# Altium schematic sheet Revision_History.SchDoc: Apalis Evaluation Board 1.1
size A3; Organization: Toradex AG; Address1: Altsagenstrasse 5; Address2: Horw; Address3: 6048; Address4: Switzerland; DocumentNumber: 1; Revision: V1.1; SheetNumber: 1; SheetTotal: 32; PageSetup: Record=PageOptions|CenterHorizontal=True|CenterVertical=True|PrintScale=0.73|XCorrection=1.00|YCorrection=1.00|PrintKind=0|BorderSize=5000000|LeftOffset=0|BottomOffset=0|Orientation=2|PaperLength=1000|PaperWidth=1000|Scale=100|PaperSource=7|PrintQuality=-4|MediaType=1|DitherType=10|PaperKind=A4|PrintScaleMode=1
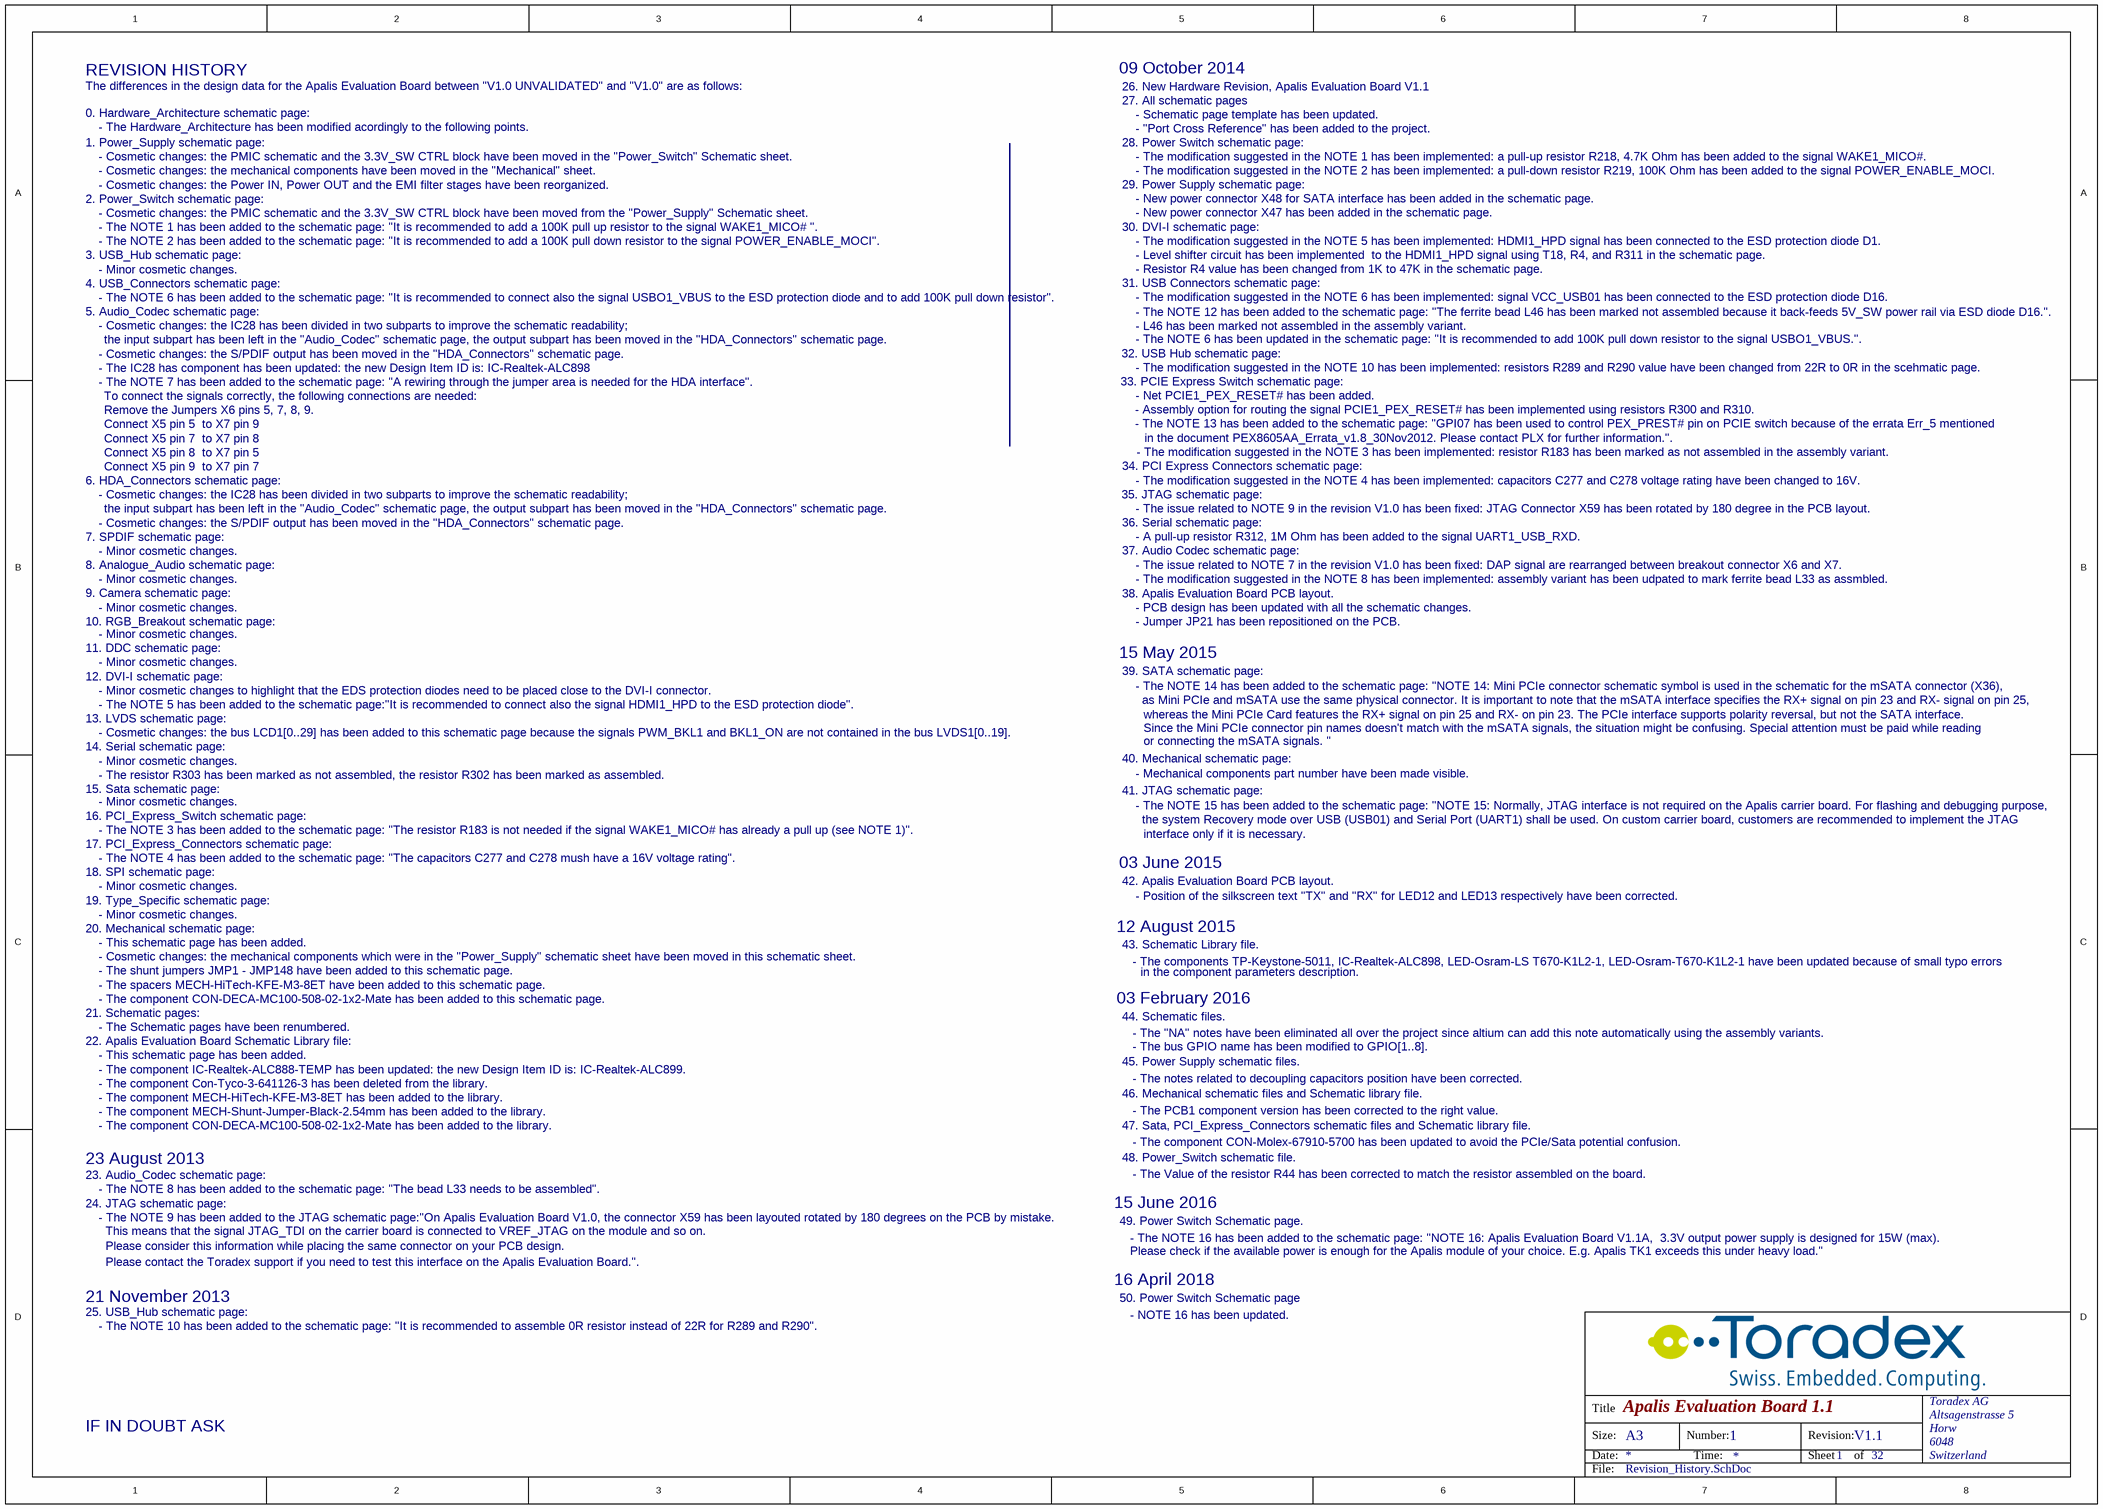
[diagram p0: Revision_History.SchDoc]

## Notes on the sheet
- The differences in the design data for the Apalis Evaluation Board between "V1.0 UNVALIDATED" and "V1.0" are as follows:
- REVISION HISTORY
- 09 October 2014
- 27. All schematic pages
- 26. New Hardware Revision, Apalis Evaluation Board V1.1
- 1. Power_Supply schematic page:
- 0. Hardware_Architecture schematic page:
- - Cosmetic changes: the PMIC schematic and the 3.3V_SW CTRL block have been moved in the "Power_Switch" Schematic sheet.
- - The Hardware_Architecture has been modified acordingly to the following points.
- - Cosmetic changes: the mechanical components have been moved in the "Mechanical" sheet.
- 28. Power Switch schematic page:
- - The modification suggested in the NOTE 2 has been implemented: a pull-down resistor R219, 100K Ohm has been added to the signal POWER_ENABLE_MOCI.
- - The modification suggested in the NOTE 1 has been implemented: a pull-up resistor R218, 4.7K Ohm has been added to the signal WAKE1_MICO#.
- - Schematic page template has been updated.
- - "Port Cross Reference" has been added to the project.
- 2. Power_Switch schematic page:
- - Cosmetic changes: the Power IN, Power OUT and the EMI filter stages have been reorganized.
- - Cosmetic changes: the PMIC schematic and the 3.3V_SW CTRL block have been moved from the "Power_Supply" Schematic sheet.
- - The NOTE 1 has been added to the schematic page: "It is recommended to add a 100K pull up resistor to the signal WAKE1_MICO# ".
- - The NOTE 2 has been added to the schematic page: "It is recommended to add a 100K pull down resistor to the signal POWER_ENABLE_MOCI".
- 30. DVI-I schematic page:
- 29. Power Supply schematic page:
- - New power connector X48 for SATA interface has been added in the schematic page.
- - The modification suggested in the NOTE 5 has been implemented: HDMI1_HPD signal has been connected to the ESD protection diode D1.
- - New power connector X47 has been added in the schematic page.
- 3. USB_Hub schematic page:
- 4. USB_Connectors schematic page:
- 5. Audio_Codec schematic page:
- - The NOTE 6 has been added to the schematic page: "It is recommended to connect also the signal USBO1_VBUS to the ESD protection diode and to add 100K pull down resistor".
- - Minor cosmetic changes.
- 31. USB Connectors schematic page:
- - Level shifter circuit has been implemented  to the HDMI1_HPD signal using T18, R4, and R311 in the schematic page.
- - Resistor R4 value has been changed from 1K to 47K in the schematic page.
- - The modification suggested in the NOTE 6 has been implemented: signal VCC_USB01 has been connected to the ESD protection diode D16.
- - The NOTE 12 has been added to the schematic page: "The ferrite bead L46 has been marked not assembled because it back-feeds 5V_SW power rail via ESD diode D16.".
- - Cosmetic changes: the IC28 has been divided in two subparts to improve the schematic readability;
- - Cosmetic changes: the S/PDIF output has been moved in the "HDA_Connectors" schematic page.
- - The IC28 has component has been updated: the new Design Item ID is: IC-Realtek-ALC898
- the input subpart has been left in the "Audio_Codec" schematic page, the output subpart has been moved in the "HDA_Connectors" schematic page.
- 33. PCIE Express Switch schematic page:
- 32. USB Hub schematic page:
- - L46 has been marked not assembled in the assembly variant.
- - The modification suggested in the NOTE 10 has been implemented: resistors R289 and R290 value have been changed from 22R to 0R in the scehmatic page.
- - The NOTE 6 has been updated in the schematic page: "It is recommended to add 100K pull down resistor to the signal USBO1_VBUS.".
- - The NOTE 7 has been added to the schematic page: "A rewiring through the jumper area is needed for the HDA interface".
- To connect the signals correctly, the following connections are needed:
- Remove the Jumpers X6 pins 5, 7, 8, 9.
- Connect X5 pin 7  to X7 pin 8
- Connect X5 pin 5  to X7 pin 9
- - Assembly option for routing the signal PCIE1_PEX_RESET# has been implemented using resistors R300 and R310.
- - The NOTE 13 has been added to the schematic page: "GPI07 has been used to control PEX_PREST# pin on PCIE switch because of the errata Err_5 mentioned
- - Net PCIE1_PEX_RESET# has been added.
- in the document PEX8605AA_Errata_v1.8_30Nov2012. Please contact PLX for further information.".
- 6. HDA_Connectors schematic page:
- Connect X5 pin 9  to X7 pin 7
- Connect X5 pin 8  to X7 pin 5
- 35. JTAG schematic page:
- 34. PCI Express Connectors schematic page:
- - The modification suggested in the NOTE 4 has been implemented: capacitors C277 and C278 voltage rating have been changed to 16V.
- - The issue related to NOTE 9 in the revision V1.0 has been fixed: JTAG Connector X59 has been rotated by 180 degree in the PCB layout.
- - The modification suggested in the NOTE 3 has been implemented: resistor R183 has been marked as not assembled in the assembly variant.
- 7. SPDIF schematic page:
- 8. Analogue_Audio schematic page:
- 36. Serial schematic page:
- 37. Audio Codec schematic page:
- - A pull-up resistor R312, 1M Ohm has been added to the signal UART1_USB_RXD.
- - The issue related to NOTE 7 in the revision V1.0 has been fixed: DAP signal are rearranged between breakout connector X6 and X7.
- - The modification suggested in the NOTE 8 has been implemented: assembly variant has been udpated to mark ferrite bead L33 as assmbled.
- 9. Camera schematic page:
- 10. RGB_Breakout schematic page:
- 11. DDC schematic page:
- 38. Apalis Evaluation Board PCB layout.
- - Jumper JP21 has been repositioned on the PCB.
- - PCB design has been updated with all the schematic changes.
- 12. DVI-I schematic page:
- 13. LVDS schematic page:
- - Minor cosmetic changes to highlight that the EDS protection diodes need to be placed close to the DVI-I connector.
- - The NOTE 5 has been added to the schematic page:"It is recommended to connect also the signal HDMI1_HPD to the ESD protection diode".
- 15 May 2015
- 39. SATA schematic page:
- - The NOTE 14 has been added to the schematic page: "NOTE 14: Mini PCIe connector schematic symbol is used in the schematic for the mSATA connector (X36),
- as Mini PCIe and mSATA use the same physical connector. It is important to note that the mSATA interface specifies the RX+ signal on pin 23 and RX- signal on pin 25,
- whereas the Mini PCIe Card features the RX+ signal on pin 25 and RX- on pin 23. The PCIe interface supports polarity reversal, but not the SATA interface.
- 14. Serial schematic page:
- - Cosmetic changes: the bus LCD1[0..29] has been added to this schematic page because the signals PWM_BKL1 and BKL1_ON are not contained in the bus LVDS1[0..19].
- - The resistor R303 has been marked as not assembled, the resistor R302 has been marked as assembled.
- 40. Mechanical schematic page:
- - Mechanical components part number have been made visible.
- Since the Mini PCIe connector pin names doesn't match with the mSATA signals, the situation might be confusing. Special attention must be paid while reading
- or connecting the mSATA signals. "
- 15. Sata schematic page:
- 16. PCI_Express_Switch schematic page:
- 17. PCI_Express_Connectors schematic page:
- - The NOTE 3 has been added to the schematic page: "The resistor R183 is not needed if the signal WAKE1_MICO# has already a pull up (see NOTE 1)".
- 41. JTAG schematic page:
- - The NOTE 15 has been added to the schematic page: "NOTE 15: Normally, JTAG interface is not required on the Apalis carrier board. For flashing and debugging purpose,
- the system Recovery mode over USB (USB01) and Serial Port (UART1) shall be used. On custom carrier board, customers are recommended to implement the JTAG
- interface only if it is necessary.
- 18. SPI schematic page:
- 19. Type_Specific schematic page:
- - The NOTE 4 has been added to the schematic page: "The capacitors C277 and C278 mush have a 16V voltage rating".
- 03 June 2015
- 42. Apalis Evaluation Board PCB layout.
- - Position of the silkscreen text "TX" and "RX" for LED12 and LED13 respectively have been corrected.
- 20. Mechanical schematic page:
- - This schematic page has been added.
- - Cosmetic changes: the mechanical components which were in the "Power_Supply" schematic sheet have been moved in this schematic sheet.
- - The shunt jumpers JMP1 - JMP148 have been added to this schematic page.
- - The spacers MECH-HiTech-KFE-M3-8ET have been added to this schematic page.
- 12 August 2015
- 43. Schematic Library file.
- - The components TP-Keystone-5011, IC-Realtek-ALC898, LED-Osram-LS T670-K1L2-1, LED-Osram-T670-K1L2-1 have been updated because of small typo errors
- in the component parameters description.
- 22. Apalis Evaluation Board Schematic Library file:
- 21. Schematic pages:
- - The Schematic pages have been renumbered.
- - The component CON-DECA-MC100-508-02-1x2-Mate has been added to this schematic page.
- 03 February 2016
- 44. Schematic files.
- - The "NA" notes have been eliminated all over the project since altium can add this note automatically using the assembly variants.
- - The bus GPIO name has been modified to GPIO[1..8].
- - The component IC-Realtek-ALC888-TEMP has been updated: the new Design Item ID is: IC-Realtek-ALC899.
- - The component Con-Tyco-3-641126-3 has been deleted from the library.
- - The component MECH-HiTech-KFE-M3-8ET has been added to the library.
- - The component MECH-Shunt-Jumper-Black-2.54mm has been added to the library.
- 45. Power Supply schematic files.
- 46. Mechanical schematic files and Schematic library file.
- - The notes related to decoupling capacitors position have been corrected.
- - The PCB1 component version has been corrected to the right value.
- 23 August 2013
- 23. Audio_Codec schematic page:
- - The component CON-DECA-MC100-508-02-1x2-Mate has been added to the library.
- - The NOTE 8 has been added to the schematic page: "The bead L33 needs to be assembled".
- 47. Sata, PCI_Express_Connectors schematic files and Schematic library file.
- 48. Power_Switch schematic file.
- - The component CON-Molex-67910-5700 has been updated to avoid the PCIe/Sata potential confusion.
- - The Value of the resistor R44 has been corrected to match the resistor assembled on the board.
- 24. JTAG schematic page:
- - The NOTE 9 has been added to the JTAG schematic page:"On Apalis Evaluation Board V1.0, the connector X59 has been layouted rotated by 180 degrees on the PCB by mistake.
- This means that the signal JTAG_TDI on the carrier board is connected to VREF_JTAG on the module and so on.
- Please consider this information while placing the same connector on your PCB design.
- 15 June 2016
- 49. Power Switch Schematic page.
- - The NOTE 16 has been added to the schematic page: "NOTE 16: Apalis Evaluation Board V1.1A,  3.3V output power supply is designed for 15W (max).
- Please check if the available power is enough for the Apalis module of your choice. E.g. Apalis TK1 exceeds this under heavy load."
- 21 November 2013
- 25. USB_Hub schematic page:
- - The NOTE 10 has been added to the schematic page: "It is recommended to assemble 0R resistor instead of 22R for R289 and R290".
- Please contact the Toradex support if you need to test this interface on the Apalis Evaluation Board.".
- 16 April 2018
- 50. Power Switch Schematic page
- - NOTE 16 has been updated.
- IF IN DOUBT ASK
- Title
- Size:
- Date:
- A3
- Number:
- Time:
- Revision:
- Sheet
- of
- File: